# EAGLE design usb-c-pcb (EAGLE 9.6.2)
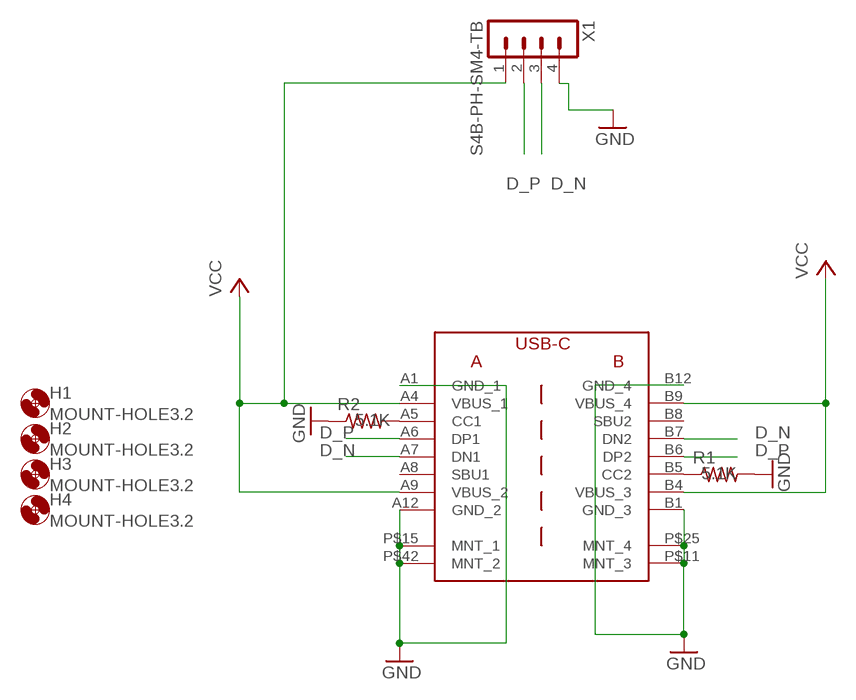
[diagram p0: schematic, sheet 1]

## Parts
H1  MOUNT-HOLE3.2  [3,2]
H2  MOUNT-HOLE3.2  [3,2]
H3  MOUNT-HOLE3.2  [3,2]
H4  MOUNT-HOLE3.2  [3,2]
R1  5.1K  R-US_R0402  [R0402]
R2  5.1K  R-US_R0402  [R0402]
U$1  USB_TAYPE_C_16P  [USB_TAYPE_C_16P]
X1  S4B-PH-SM4-TB  [S4B-PH-SM4-TB]

## Nets
D_N: U$1.A7(DN1) U$1.B7(DN2) X1.3
D_P: U$1.A6(DP1) U$1.B6(DP2) X1.2
GND: R1.2 R2.1 U$1.A1(GND_1) U$1.A12(GND_2) U$1.B1(GND_3) U$1.B12(GND_4) U$1.P$11(MNT_3) U$1.P$15(MNT_1) U$1.P$25(MNT_4) U$1.P$42(MNT_2) X1.4
N$2: R1.1 U$1.B5(CC2)
N$3: R2.2 U$1.A5(CC1)
VCC: U$1.A4(VBUS_1) U$1.A9(VBUS_2) U$1.B4(VBUS_3) U$1.B9(VBUS_4) X1.1
Unconnected: U$1.A8(SBU1) U$1.B8(SBU2)

## Library data of the parts
H1-H4 = holes:MOUNT-HOLE: MOUNTING HOLE with drill center marker
R1 R2 = rcl:R-US_: RESISTOR, American symbol; SPICEPREFIX: R
U$1 = USB_TYPE_C_20250825:USB_TAYPE_C_16P: HX-TYPE-C 24P-1.6, USB C 3.2 REC, HORZ
X1 = con-JST PH:S4B-PH: JST PH series header 2.00mm pitch disconnectable crimp style connectors, horizontal (side entry type), 4 pins

## Board
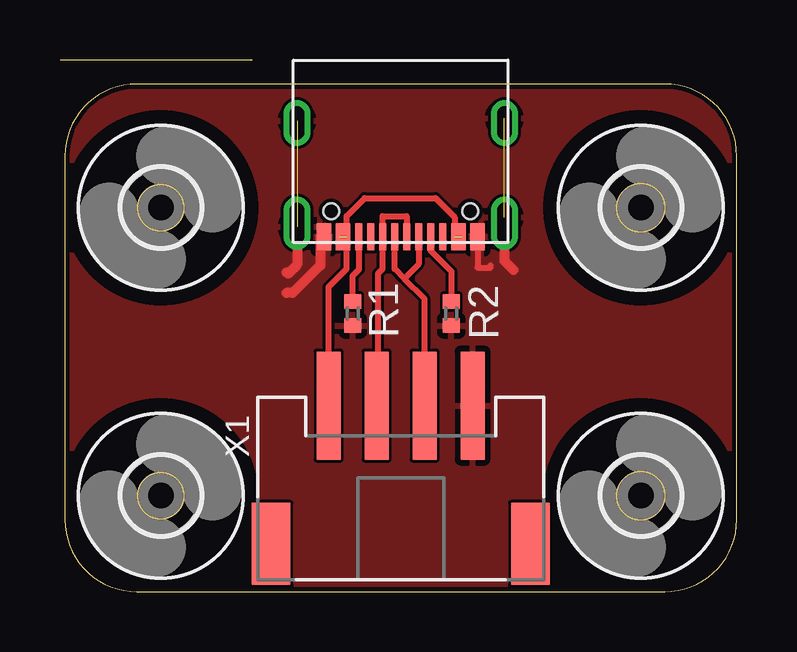
[diagram p1: board, top side]

Size 28.2 x 22.15 mm. Coordinates in mm from the lower left corner, seen from the top.
Outline: 8,22.15 0,22.15
Outline: 3.2,0 25.2,0 arc90 28.2,3 28.2,18.15 arc90 25.2,21.15 3.2,21.15 arc90 0.2,18.15 0.2,3 arc90 3.2,0
Outline: circle at 4.2,4 radius 0.96
Outline: circle at 24.2,4 radius 1
Outline: circle at 4.2,16 radius 0.96
Outline: circle at 24.2,16 radius 1
Copper layers (1*16): Top 0.035mm / dielectric 1.6mm / Bottom 0.035mm
Design rules "jlcpcb-2layers": minimum track width 5mil, minimum drill 0.3mm, track to track 5mil, track to pad 5mil, pad to pad 5mil, via to via 5mil, smd to smd 5mil, copper to edge 0.2mm, drill to drill 6mil, minimum pad ring 10mil, minimum via ring 3mil, stop-mask expansion 4mil, vias tented up to drill 0mil, thermal gap 10mil

### Footprints (pad centres in the part's own frame; a part is rotated, then mirrored left to right if it is on the bottom)
3,2 = hole 3.2: 0,0
R0402 = smd 0.6 x 0.7: 1 -0.5,0; 2 0.5,0
USB_TAYPE_C_16P = smd 0.3 x 1.14: A1 -3.35,0.56; A4 -2.55,0.56; A5 -1.25,0.56; A6 -0.25,0.56; A7 0.25,0.56; A8 1.25,0.56; A9 2.25,0.56; A12 3.35,0.56; B1 3.05,0.56; B4 2.55,0.56; B5 1.75,0.56; B6 0.75,0.56; B7 -0.75,0.56; B8 -1.75,0.56; B9 -2.25,0.56; B12 -3.05,0.56 | drill 0.6 pad 1: P$1 4.32,-3.78; P$2 4.32,0.55; P$3 4.32,0.45; P$4 -4.32,0.55; P$5 -4.32,0.45; P$6 4.32,-3.88; P$7 -4.32,0.25; P$8 -4.32,0.35; P$9 4.32,-4.08; P$10 4.32,-3.98; P$11 4.32,-4.28; P$12 4.32,-4.48; P$13 -4.32,0.05; P$14 -4.32,-0.15; P$15 -4.32,-0.25; P$16 -4.32,0.15; P$17 4.32,0.25; P$18 -4.32,-0.35; P$19 -4.32,-0.05; P$20 -4.32,-0.45; P$21 -4.32,-0.55; P$22 4.32,0.35; P$23 4.32,0.05; P$24 4.32,-0.25; P$25 4.32,0.15; P$26 4.32,-0.45; P$27 4.32,-0.15; P$28 4.32,-0.55; P$29 4.32,-0.05; P$30 4.32,-0.35; P$31 4.32,-4.18; P$32 -4.32,-4.58; P$33 -4.32,-4.48; P$34 -4.32,-3.88; P$35 4.32,-4.38; P$36 4.32,-4.58; P$37 -4.32,-3.78; P$38 -4.32,-4.08; P$39 -4.32,-4.28; P$40 -4.32,-3.98; P$41 -4.32,-4.18; P$42 -4.32,-4.38 | hole 0.65: -2.89,-0.5; 2.89,-0.5
S4B-PH-SM4-TB = smd 1 x 4.5: 1 3,0; 2 1,0; 3 -1,0; 4 -3,0 | smd 1.6 x 3.4: M1 5.4,5.75; M2 -5.4,5.75

### Placement (x,y rotation side)
H1  4.2,16 0 top
H2  4.2,4 0 top
H3  24.2,16 0 top
H4  24.2,4 0 top
R1  12.2,11.59 270 top
R2  16.31,11.59 90 top
U$1  14.2,15.35 180 top
X1  14.2,7.75 180 top

### Tracks (layer width: path | path; a pad name or v marks a point on that pad's centre or on a via)
D_N
  Top 0.254: X1.3 15.2,12.2 14.35,13.05 | U$1.A7 13.95,13.45 14.35,13.05 | U$1.B7 14.95,13.65 14.35,13.05
D_P
  Top 0.254: X1.2 13.25,7.8 13.25,13.25 13.45,13.45 U$1.B6 13.45,15.65 14.45,15.65 U$1.A6
GND  (2 unrouted)
  Top 0.254: U$1.A1 17.4,14.64 17.4,13.5 17.95,13.5 17.95,13.6
  Top 0.406: U$1.A12 10.85,13.6 9.7,12.45 9.45,12.45 | U$1.P$25 9.88,13.63 9.5,13.25 9.45,13.3 | U$1.P$15 18.52,13.78 18.9,13.4
  pour Top: 12.4,21.2 25.2,21.2 arc-90 28.2,18.2 28.2,3 arc-90 25.2,0 3.3,0 arc-90 0.3,3 0.3,18.2 arc-90 3.3,21.2
N$2
  Top 0.254: R1.1 12.2,13.16 12.45,13.42 U$1.B5
N$3
  Top 0.254: U$1.A5 15.44,14.22 16.31,13.35 R2.2
VCC  (2 unrouted)
  Top 0.254: X1.1 11.2,12.7 11.95,13.45 U$1.A9 11.95,15.65 12.7,16.4 15.65,16.4 16.45,15.6 U$1.B9